# Altium project Power.PrjPcb
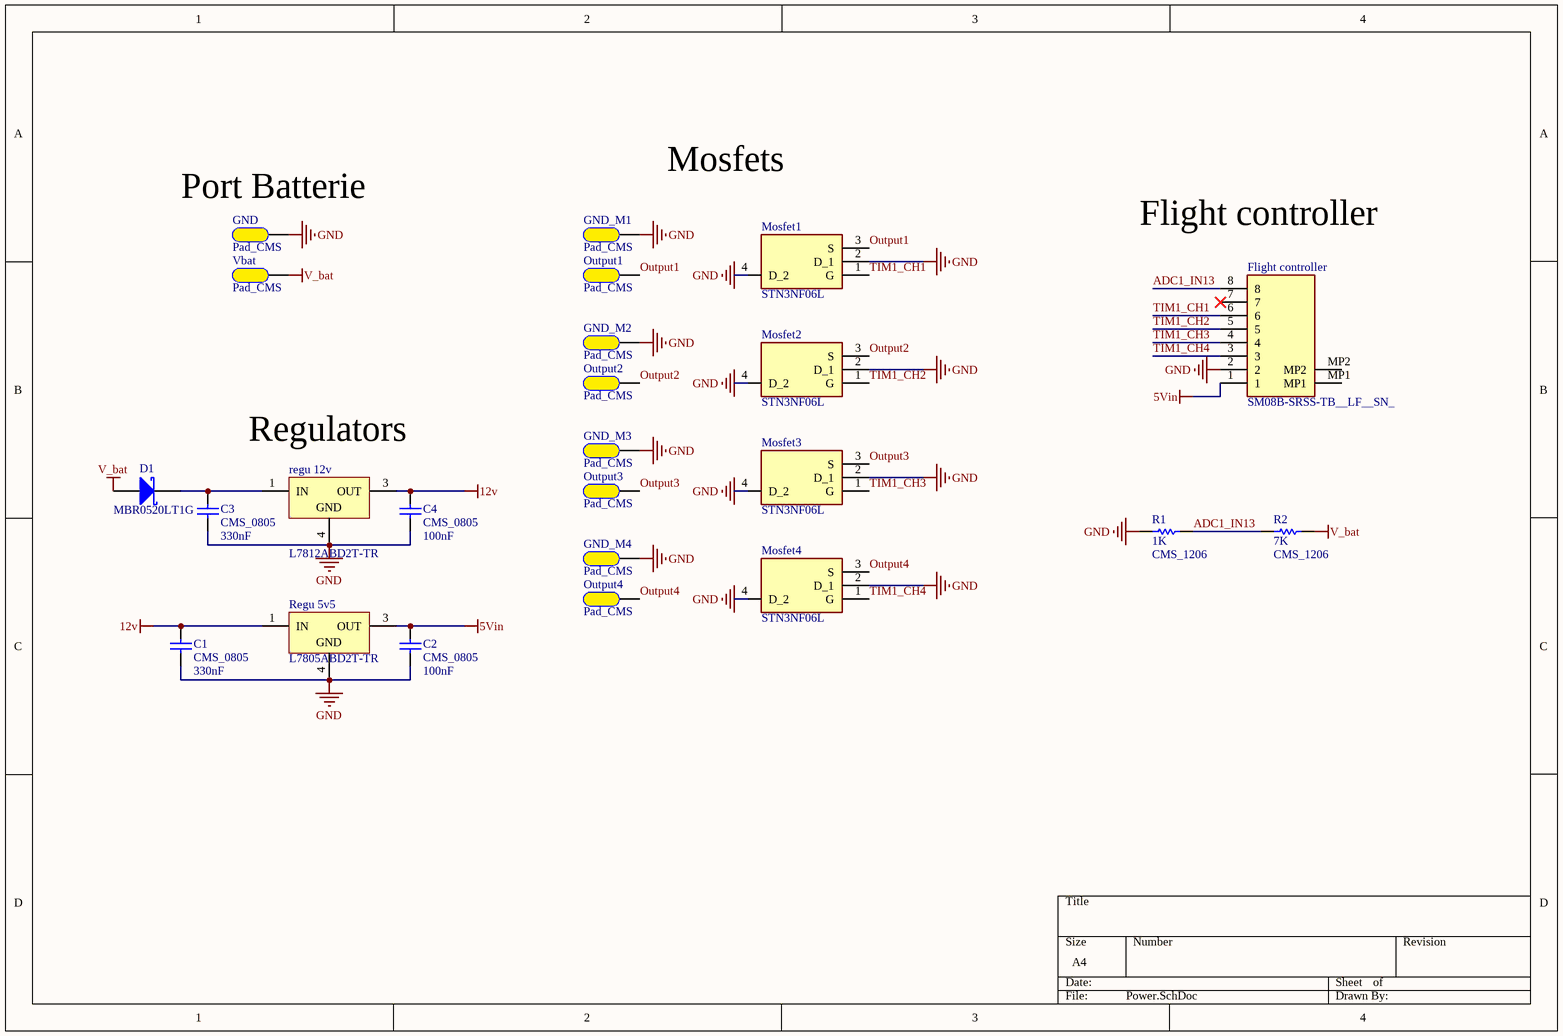
[diagram p0: Power.SchDoc]
1 sheet, 24 parts. Net scope: global (net labels, ports and power ports of the same name join across sheets).
Board file: Power.PcbDoc

## Sheet Power.SchDoc
size A4; SheetNumber: 1; SheetTotal: 1

### Parts
C1  value 330nF  [CONDENSATEUR_CMS_0805]  (hidden comment: CMS_0805)
C2  value 100nF  [CONDENSATEUR_CMS_0805]  (hidden comment: CMS_0805)
C3  value 330nF  [CONDENSATEUR_CMS_0805]  (hidden comment: CMS_0805)
C4  value 100nF  [CONDENSATEUR_CMS_0805]  (hidden comment: CMS_0805)
D1  MBR0520LT1G  [ONSC-SOD-123-2-425-04_V]
Flight_controller  SM08B-SRSS-TB__LF__SN_  [SM08BSRSSTBLFSN]
GND  Pad_CMS  [PAD_CMS_5.08x2.54]
GND_M1  Pad_CMS  [PAD_CMS_5.08x2.54]
GND_M2  Pad_CMS  [PAD_CMS_5.08x2.54]
GND_M3  Pad_CMS  [PAD_CMS_5.08x2.54]
GND_M4  Pad_CMS  [PAD_CMS_5.08x2.54]
Mosfet1  STN3NF06L  [SOT230P700X190-4N]
Mosfet2  STN3NF06L  [SOT230P700X190-4N]
Mosfet3  STN3NF06L  [SOT230P700X190-4N]
Mosfet4  STN3NF06L  [SOT230P700X190-4N]
Output1  Pad_CMS  [PAD_CMS_5.08x2.54]
Output2  Pad_CMS  [PAD_CMS_5.08x2.54]
Output3  Pad_CMS  [PAD_CMS_5.08x2.54]
Output4  Pad_CMS  [PAD_CMS_5.08x2.54]
R1  value 1K  Type: CMS_1206  [RESISTANCE_CMS_1206]  (hidden comment: RESISTANCE_CMS_1206)
R2  value 7K  Type: CMS_1206  [RESISTANCE_CMS_1206]  (hidden comment: RESISTANCE_CMS_1206)
Regu_5v5  L7805ABD2T-TR  [TO-263_M]
regu_12v  L7812ABD2T-TR  [TO-263_L]
Vbat  Pad_CMS  [PAD_CMS_5.08x2.54]

### Nets
5Vin: C2.1 Flight_controller.1 Regu_5v5.3(OUT)
12v: C1.1 C4.1 Regu_5v5.1(IN) regu_12v.3(OUT)
GND: C1.2 C2.2 C3.2 C4.2 Flight_controller.2 GND.1 GND_M1.1 GND_M2.1 GND_M3.1 GND_M4.1 Mosfet1.2(D_1) Mosfet1.4(D_2) Mosfet2.2(D_1) Mosfet2.4(D_2) Mosfet3.2(D_1) Mosfet3.4(D_2) Mosfet4.2(D_1) Mosfet4.4(D_2) R1.1 Regu_5v5.4(GND) regu_12v.4(GND)
V_bat: D1.1(A) R2.2 Vbat.1
ADC1_IN13: Flight_controller.8 R1.2 R2.1
Output1: Mosfet1.3(S) Output1.1
Output2: Mosfet2.3(S) Output2.1
Output3: Mosfet3.3(S) Output3.1
Output4: Mosfet4.3(S) Output4.1
TIM1_CH1: Flight_controller.6 Mosfet1.1(G)
TIM1_CH2: Flight_controller.5 Mosfet2.1(G)
TIM1_CH3: Flight_controller.4 Mosfet3.1(G)
TIM1_CH4: Flight_controller.3 Mosfet4.1(G)
NetC3_1: C3.1 D1.2(K) regu_12v.1(IN)

Not connected (* = marked no-connect by the designer): Flight_controller 7* MP1 MP2

### Notes on the sheet
- Mosfets
- (near GND) Port Batterie
- Flight controller
- Regulators

### Library data of the parts
C1-C4 = CONDENSATEUR_CMS_CER_0805: CONDENSATEUR CMS CERAMIQUE 0805; Type: CMS_0805
D1 = CMP-004-00003-1: Schottky Power Rectifier, 20 V, 5.5 A, -65 to 125 degC, 2-Pin SMD, RoHS, Tape and Reel; Manufacturer: ON Semiconductor; Peak Reverse Current: 250uA; Max Surge Current: 5.5A; Forward Voltage: 3.85dV; Forward Current: 5dA; Elements: 1; Datasheet Version: Rev. 6, 01/2012; Max Operating Temperature: 125°C; RoHS Compliant: True; Manufacturer URL: http://www.onsemi.com/; Packaging: TapeandReel; Datasheet URL: http://www.onsemi.cn/pub_link/Collateral/MBR0520LT1-D.PDF; Package Reference: SOD-123-2-425-04; Package Quantity: 3000; Min Operating Temperature: -65°C; Mounting Technology: SM; Package Description: 2-Pin Surface Mount Device, Body 2.69 x 1.6 mm; Case/Package: SOD; Pins: 2
Flight_controller = SM08B-SRSS-TB__LF__SN_: Connector; Manufacturer_Name: JST (JAPAN SOLDERLESS TERMINALS); Manufacturer_Part_Number: SM08B-SRSS-TB (LF)(SN); Datasheet Link: http://docs-emea.rs-online.com/webdocs/082f/0900766b8082f545.pdf; Height: 2.9mm; Arrow Part Number: SM08B-SRSS-TB (LF)(SN); Arrow Price/Stock: https://www.arrow.com/en/products/sm08b-srss-tb-lf-sn/jst-manufacturing
GND GND_M1-GND_M4 Output1-Output4 Vbat = Pad_CMS: Pad pour souder un fil; LatestRevisionNote: Mech Layer 1 removed.; PackageReference: PAD_CMS; Publisher: Damien Guitton
Mosfet1-Mosfet4 = STN3NF06L: MOSFET (N-Channel); Manufacturer_Name: STMicroelectronics; Datasheet Link: https://www.st.com/resource/en/datasheet/stn3nf06l.pdf; Height: 1.9mm; Manufacturer_Part_Number: STN3NF06L; Mouser Part Number: 511-STN3NF06L; Mouser Price/Stock: https://www.mouser.co.uk/ProductDetail/STMicroelectronics/STN3NF06L?qs=VREXnN%2FAp%252BtujmZVCVKGgA%3D%3D
R1 R2 = RESISTANCE_CMS_1206: RESISTANCE CMS 1206
Regu_5v5 = CMP-0244-00199-1: Positive Voltage Regulator, 3-Pin D2PAK, Tape and Reel; ComponentLink1Description: Manufacturer URL; ComponentLink1URL: http://www.st.com; ComponentLink2URL: http://www.st.com/internet/com/TECHNICAL_RESOURCES/TECHNICAL_LITERATURE/DATASHEET/CD00000444.pdf; PackageDescription: 3-Pin Transistor Outline Package 2.54 mm Pitch, 15.4 mm Lead Span (D2PAK); PackageVersion: 2011; PackageReference: TO-263; DatasheetVersion: 16/11/2011; ComponentLink2Description: Datasheet
regu_12v = CMP-0244-00181-1: Positive Voltage Regulator, 3-Pin D2PAK, Tape and Reel; ComponentLink1Description: Manufacturer URL; ComponentLink2URL: http://www.st.com/internet/com/TECHNICAL_RESOURCES/TECHNICAL_LITERATURE/DATASHEET/CD00000444.pdf; PackageVersion: 2011; PackageDescription: 3-Pin Transistor Outline Package 2.54 mm Pitch, 15.4 mm Lead Span (D2PAK); DatasheetVersion: 16/11/2011; PackageReference: TO-263; ComponentLink1URL: http://www.st.com; ComponentLink2Description: Datasheet